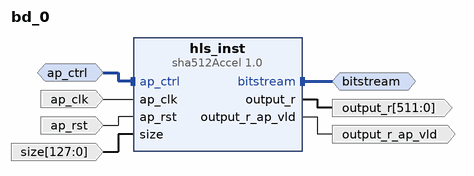
[diagram p0: block diagram of the top level]
# Vivado block design bd_0, xa7s6cpga196-2I, Vivado 2025.1
create_bd_design bd_0

create_bd_intf_port -mode Slave -vlnv xilinx.com:interface:acc_handshake_rtl:1.0 ap_ctrl
create_bd_intf_port -mode Master -vlnv xilinx.com:interface:acc_fifo_read_rtl:1.0 bitstream
create_bd_port -dir I -type clk ap_clk
set_property -dict {CONFIG.FREQ_HZ 100000000.0} [get_bd_ports ap_clk]
create_bd_port -dir I -type rst ap_rst
set_property -dict {CONFIG.POLARITY ACTIVE_HIGH} [get_bd_ports ap_rst]
create_bd_port -dir O -from 511 -to 0 -type data output_r
create_bd_port -dir O output_r_ap_vld
create_bd_port -dir I -from 127 -to 0 -type data size

create_bd_cell -type ip -vlnv xilinx.com:hls:sha512Accel:1.0 hls_inst

# ---- connections ----

connect_bd_intf_net -intf_net ap_ctrl_0_1 [get_bd_intf_ports ap_ctrl] [get_bd_intf_pins hls_inst/ap_ctrl]
connect_bd_intf_net [get_bd_intf_ports bitstream] [get_bd_intf_pins hls_inst/bitstream]
connect_bd_net -net ap_clk_0_1 [get_bd_ports ap_clk] [get_bd_pins hls_inst/ap_clk]
connect_bd_net -net ap_rst_0_1 [get_bd_ports ap_rst] [get_bd_pins hls_inst/ap_rst]
connect_bd_net [get_bd_pins hls_inst/output_r] [get_bd_ports output_r]
connect_bd_net [get_bd_pins hls_inst/output_r_ap_vld] [get_bd_ports output_r_ap_vld]
connect_bd_net -net size_0_1 [get_bd_ports size] [get_bd_pins hls_inst/size]

validate_bd_design
save_bd_design
